# EAGLE schematic spidmx (EAGLE 7.2.0)
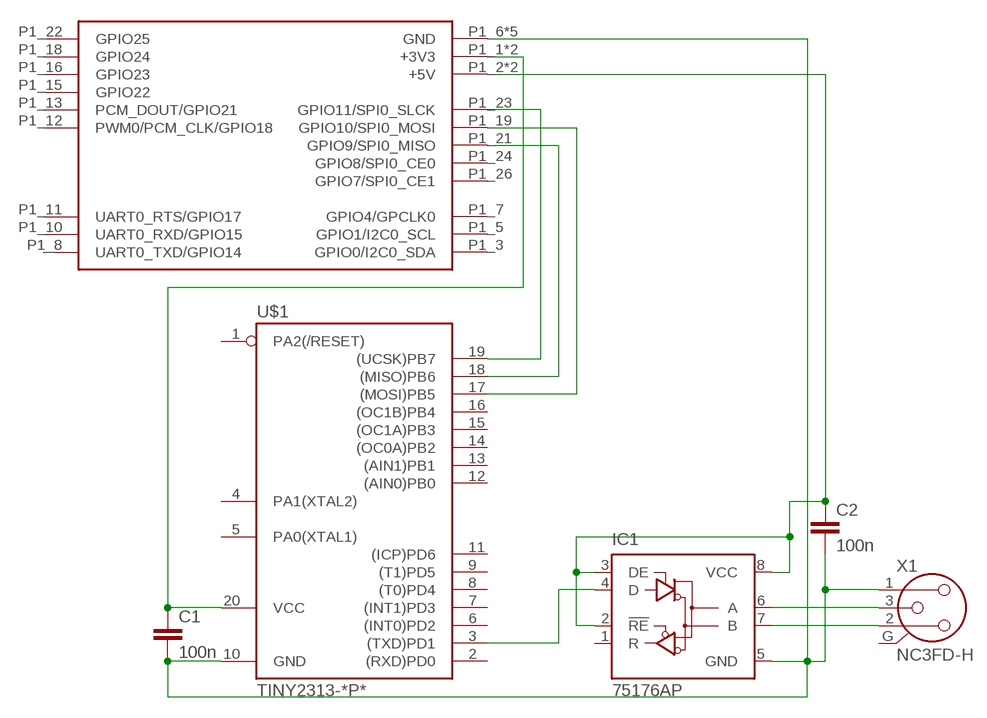
[diagram p0: schematic, sheet 1]

## Parts
C1  100n  C-EUC0805  [C0805]
C2  100n  C-EUC0805  [C0805]
IC1  75176AP  [DIL08]
U$1  TINY2313-*P*  [DIL20]
U$2  RPI-B-V1  [RPI-B-V1]
X1  NC3FD-H  [NC3FD-H]

## Nets
N$1: C1.1 U$1.20(VCC) U$2.P1_1(+3V3) U$2.P1_17(+3V3)
N$2: C1.2 C2.2 IC1.5(GND) U$1.10(GND) U$2.P1_6(GND) U$2.P1_9(GND) U$2.P1_14(GND) U$2.P1_20(GND) U$2.P1_25(GND) X1.1
N$5: IC1.6(A) X1.3
N$6: IC1.7(B) X1.2
N$7: C2.1 IC1.2(!RE) IC1.3(DE) IC1.8(VCC) U$2.P1_2(+5V) U$2.P1_4(+5V)
N$8: IC1.4(D) U$1.3((TXD)PD1)
N$9: U$1.18((MISO)PB6) U$2.P1_21(GPIO9/SPI0_MISO)
N$10: U$1.17((MOSI)PB5) U$2.P1_19(GPIO10/SPI0_MOSI)
N$11: U$1.19((UCSK)PB7) U$2.P1_23(GPIO11/SPI0_SLCK)
Unconnected: IC1.1(R) U$1.1(PA2(/RESET)) U$1.2((RXD)PD0) U$1.4(PA1(XTAL2)) U$1.5(PA0(XTAL1)) U$1.6((INT0)PD2) U$1.7((INT1)PD3) U$1.8((T0)PD4) U$1.9((T1)PD5) U$1.11((ICP)PD6) U$1.12((AIN0)PB0) U$1.13((AIN1)PB1) U$1.14((OC0A)PB2) U$1.15((OC1A)PB3) U$1.16((OC1B)PB4) U$2.P1_3(GPIO0/I2C0_SDA) U$2.P1_5(GPIO1/I2C0_SCL) U$2.P1_7(GPIO4/GPCLK0) U$2.P1_8(UART0_TXD/GPIO14) U$2.P1_10(UART0_RXD/GPIO15) U$2.P1_11(UART0_RTS/GPIO17) U$2.P1_12(PWM0/PCM_CLK/GPIO18) U$2.P1_13(PCM_DOUT/GPIO21) U$2.P1_15(GPIO22) U$2.P1_16(GPIO23) U$2.P1_18(GPIO24) U$2.P1_22(GPIO25) U$2.P1_24(GPIO8/SPI0_CE0) U$2.P1_26(GPIO7/SPI0_CE1) X1.G

## Library data of the parts
C1 C2 = resistor:C-EU: CAPACITOR, European symbol
IC1 = 751xx:75176A: DIFFERENTIAL BUS TRANSCEIVER Source: http://focus.ti.com/lit/ds/symlink/sn75176a.pdf
U$1 = avr-7:TINY2313*: Atmel Tiny2313 2K Flash, 128 bytes EEPROM, 128 bytes RAM
U$2 = raspberrypi:RPI-B-V1: First revision of the Model B board without P5 and P6 headers and mounting holes. Choose the "SHIELD" variant for a predefined Dimension layer.
X1 = con-neutrik_ag:NC3: Neutrik Audio Connector XLR SERIES Stereo 1/4" jack Source: www.neutrik.com/; MF: NEUTRIK; MPN: NC3FD-H; OC_FARNELL: 1608398; OC_NEWARK: 87F6600